# Altium schematic sheet Prijemnik.SchDoc
size A3
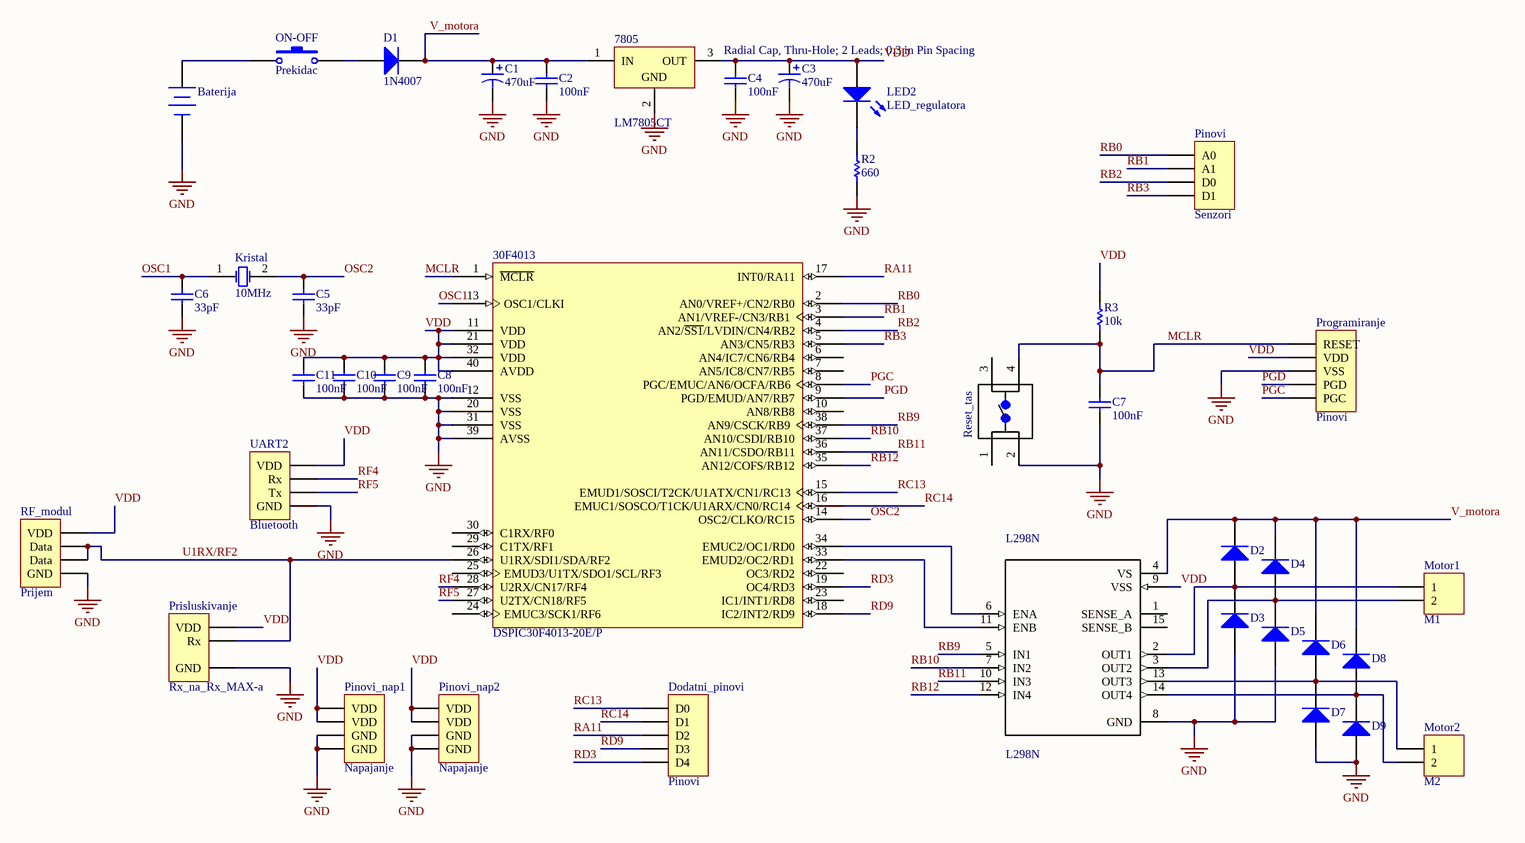
[diagram p0: Prijemnik.SchDoc]

## Parts
30F4013  DSPIC30F4013-20E/P  [PDIP600-P40]
7805  LM7805CT  [T03B]
Baterija  9V  [BAT-2]  (value not drawn)
C1  470uF  [El. Kondenzator 470uf]
C2  100nF  [C blok 100n]
C3  470uF  [El. Kondenzator 470uf]
C4  100nF  PackageDescription: Radial Cap, Thru-Hole; 2 Leads; 0.3 in Pin Spacing  [C blok 100n]
C5  33pF  [C keramicki 30pF]
C6  33pF  [C keramicki 30pF]
C7  100nF  [C blok 100n]
C8  100nF  [C blok 100n]
C9  100nF  [C blok 100n]
C10  100nF  [C blok 100n]
C11  100nF  [C blok 100n]
D1  1N4007  [DO-41]
D2  Diode 1N4007  [DO-41]  (value not drawn)
D3  Diode 1N4007  [DO-41]  (value not drawn)
D4  Diode 1N4007  [DO-41]  (value not drawn)
D5  Diode 1N4007  [DO-41]  (value not drawn)
D6  Diode 1N4007  [DO-41]  (value not drawn)
D7  Diode 1N4007  [DO-41]  (value not drawn)
D8  Diode 1N4007  [DO-41]  (value not drawn)
D9  Diode 1N4007  [DO-41]  (value not drawn)
Dodatni_pinovi  Pinovi  [HDR1X5]
Kristal  10MHz  [R38]
L298N  L298N  [*TO127P2020X500X2100-15]
LED2  LED_regulatora  [LED_5mm]
Motor1  M1  [HDR1X2]
Motor2  M2  [HDR1X2]
ON-OFF  Prekidac  [SPST-2]
Pinovi  Senzori  [HDR1X4]
Pinovi_nap1  Napajanje  [HDR1X4]
Pinovi_nap2  Napajanje  [HDR1X4]
Prisluskivanje  Rx_na_Rx_MAX-a  [HDR1X3]
Programiranje  Pinovi  [HDR1X5]
R2  660  [AXIAL-0.3]
R3  10k  [AXIAL-0.3]
Reset_tas  3-1825910-1  [*TE_3-1825910-1]  (value not drawn)
RF_modul  Prijem  [HDR1X4]
UART2  Bluetooth  [HDR1X4]

## Nets
GND: 30F4013.12(VSS) 30F4013.20(VSS) 30F4013.31(VSS) 30F4013.39(AVSS) 7805.2(GND) Baterija.2(-) C1.2 C2.1 C3.2 C4.1 C5.1 C6.1 C7.1 C8.1 C9.1 C10.1 C11.1 D3.1(A) D5.1(A) D7.1(A) D9.1(A) L298N.8(GND) Pinovi_nap1.3(GND) Pinovi_nap1.4(GND) Pinovi_nap2.3(GND) Pinovi_nap2.4(GND) Prisluskivanje.3(GND) Programiranje.3(VSS) R2.1 Reset_tas.2 RF_modul.4(GND) UART2.4(GND)
MCLR: 30F4013.1(~{MCLR}) C7.2 Programiranje.1(RESET) R3.1 Reset_tas.4
OSC1: 30F4013.13(OSC1/CLKI) C6.2 Kristal.1(OSC1)
OSC2: 30F4013.14(OSC2/CLKO/RC15) C5.2 Kristal.2(OSC2)
PGC: 30F4013.8(PGC/EMUC/AN6/OCFA/RB6) Programiranje.5(PGC)
PGD: 30F4013.9(PGD/EMUD/AN7/RB7) Programiranje.4(PGD)
RA11: 30F4013.17(INT0/RA11) Dodatni_pinovi.3(D2)
RB0: 30F4013.2(AN0/VREF+/CN2/RB0) Pinovi.1(A0)
RB1: 30F4013.3(AN1/VREF-/CN3/RB1) Pinovi.2(A1)
RB2: 30F4013.4(AN2/~{SS1}/LVDIN/CN4/RB2) Pinovi.3(D0)
RB3: 30F4013.5(AN3/CN5/RB3) Pinovi.4(D1)
RB9: 30F4013.38(AN9/CSCK/RB9) L298N.5(IN1)
RB10: 30F4013.37(AN10/CSDI/RB10) L298N.7(IN2)
RB11: 30F4013.36(AN11/CSDO/RB11) L298N.10(IN3)
RB12: 30F4013.35(AN12/COFS/RB12) L298N.12(IN4)
RC13: 30F4013.15(EMUD1/SOSCI/T2CK/U1ATX/CN1/RC13) Dodatni_pinovi.1(D0)
RC14: 30F4013.16(EMUC1/SOSCO/T1CK/U1ARX/CN0/RC14) Dodatni_pinovi.2(D1)
RD3: 30F4013.19(OC4/RD3) Dodatni_pinovi.5(D4)
RD9: 30F4013.18(IC2/INT2/RD9) Dodatni_pinovi.4(D3)
RF4: 30F4013.28(U2RX/CN17/RF4) UART2.2(Rx)
RF5: 30F4013.27(U2TX/CN18/RF5) UART2.3(Tx)
U1RX/RF2: 30F4013.26(U1RX/SDI1/SDA/RF2) Prisluskivanje.2(Rx) RF_modul.2(Data) RF_modul.3(Data)
V_motora: 7805.1(IN) C1.1 C2.2 D1.2(K) D2.2(K) D4.2(K) D6.2(K) D8.2(K) L298N.4(VS)
VDD: 30F4013.11(VDD) 30F4013.21(VDD) 30F4013.32(VDD) 30F4013.40(AVDD) 7805.3(OUT) C3.1 C4.2 C8.2 C9.2 C10.2 C11.2 L298N.9(VSS) LED2.1(A) Pinovi_nap1.1(VDD) Pinovi_nap1.2(VDD) Pinovi_nap2.1(VDD) Pinovi_nap2.2(VDD) Prisluskivanje.1(VDD) Programiranje.2(VDD) R3.2 RF_modul.1(VDD) UART2.1(VDD)
Net30F4013_33: 30F4013.33(EMUD2/OC2/RD1) L298N.11(ENB)
Net30F4013_34: 30F4013.34(EMUC2/OC1/RD0) L298N.6(ENA)
NetBaterija_1: Baterija.1(+) ON-OFF.1
NetD1_1: D1.1(A) ON-OFF.2
NetD2_1: D2.1(A) D3.2(K) L298N.2(OUT1) Motor1.1
NetD4_1: D4.1(A) D5.2(K) L298N.3(OUT2) Motor1.2
NetD6_1: D6.1(A) D7.2(K) L298N.13(OUT3) Motor2.1
NetD8_1: D8.1(A) D9.2(K) L298N.14(OUT4) Motor2.2
NetLED2_2: LED2.2(K) R2.2

Not connected (* = marked no-connect by the designer): 30F4013 6(AN4/IC7/CN6/RB4) 7(AN5/IC8/CN7/RB5) 10(AN8/RB8) 22(OC3/RD2) 23(IC1/INT1/RD8) 24(EMUC3/SCK1/RF6) 25(EMUD3/U1TX/SDO1/SCL/RF3) 29(C1TX/RF1) 30(C1RX/RF0); L298N 1(SENSE_A) 15(SENSE_B); Reset_tas 1 3

## Library data of the parts
30F4013 = DSPIC30F4013-20E/P: High-Performance 16-bit Digital Signal Controller, 48 KB Flash, 2 KB SRAM, 1 KB EEPROM, 40-Pin PDIP, Extended High Temperature; Published: 29-Jan-2009; DatasheetVersion: revF, Apr-2008; PackageVersion: revBB, Aug-2009; PackageReference: PDIP600-P40; Publisher: Altium Limited; PackageDescription: 40-Lead Plastic Dual In-Line (P) - 600 mil Body [PDIP]; Supplier 1: Digi-Key; Supplier Part Number 1: DSPIC30F4013-20EP-ND; ComponentLink1Description: Datasheet; ComponentLink1URL: http://ww1.microchip.com/downloads/en/DeviceDoc/70138F.pdf; ComponentLink2Description: Packaging Specification; ComponentLink2URL: http://www.microchip.com/stellent/groups/techpub_sg/documents/packagingspec/en012702.pdf; ComponentLink3Description: Microchip.com Home; ComponentLink3URL: http://www.microchip.com/
7805 = LM7905CT: 3-Terminal Negative Regulator, 3-pin TO-220; Manufacturer: National Semiconductor; PackageTopMarking: NSUZXYTTE#*LM7905CT; PowerWise: N; CompType: LDO IC; Published: 4-Dec-2008; DatasheetVersion: Sep-2001; PackageVersion: revL, Jan-1992; PackageReference: T03B; Publisher: Altium Limited; PackageDescription: TO-220, Molded, 3 Lead, Straight; Supplier 1: Farnell; Supplier Part Number 1: 9490370; PartNumber: LM7905CT; RoHS: N; PinCount: 3; ComponentLink1Description: LM7905 Datasheet; ComponentLink1URL: http://www.national.com/ds/LM/LM7905.pdf; ComponentLink2Description: LM7905 Web Page; ComponentLink2URL: http://www.national.com/pf/LM/LM7905.html; ComponentLink3Description: T03B Package Page; ComponentLink3URL: http://www.national.com/packaging/folders/t03b.html
Baterija = Battery: Multicell Battery; Published: 24-Mar-1999; LatestRevisionDate: 17-Jul-2002; LatestRevisionNote: Re-released for DXP Platform.; PackageReference: BAT-2; Publisher: Altium Limited; PackageDescription: Battery; 2 Leads
C1 C3 = Cap Pol1: Polarized Capacitor (Radial); Published: 8-Jun-2000; LatestRevisionDate: 17-Jul-2002; LatestRevisionNote: Re-released for DXP Platform.; PackageReference: RB7.6-15; Publisher: Altium Limited; PackageDescription: Polarized Capacitor (Radial); 2 Leads; Value: 470uF
C2 C4-C11 = Cap: Capacitor; Published: 8-Jun-2000; LatestRevisionDate: 17-Jul-2002; LatestRevisionNote: Re-released for DXP Platform.; PackageReference: RAD-0.3; Publisher: Altium Limited
  C2 C7-C11: PackageDescription: Radial Cap, Thru-Hole; 2 Leads; 0.3 in Pin Spacing; Value: 100nF
  C4: Value: 100nF
  C5 C6: PackageDescription: Radial Cap, Thru-Hole; 2 Leads; 0.3 in Pin Spacing; Value: 33pF
D1-D9 = Diode 1N4007: 1 Amp General Purpose Rectifier; Published: 8-Jun-2000; LatestRevisionDate: 17-Jul-2002; LatestRevisionNote: Re-released for DXP Platform.; DatasheetVersion: 1998; PackageVersion: Aug-1999; PackageReference: DO-41; Publisher: Altium Limited; PackageDescription: Diode, Axial; Body 5.2 x 2.7 mm (LxDia. max), Lead Dia. 0.86 mm (max); Code_JEDEC: DO-204-AL; ComponentLink1Description: Manufacturer Link; ComponentLink1URL: http://www.fairchildsemi.com/; ComponentLink2Description: Datasheet; ComponentLink2URL: http://www.fairchildsemi.com/ds/1N%2F1N4001.pdf
Dodatni_pinovi Programiranje = Header 5: Header, 5-Pin; LatestRevisionDate: 17-Jul-2002; LatestRevisionNote: Re-released for DXP Platform.; Publisher: Altium Limited
Kristal = XTAL: Crystal Oscillator; Published: 8-Jun-2000; LatestRevisionDate: 17-Jul-2002; LatestRevisionNote: Re-released for DXP Platform.; PackageReference: R38; Publisher: Altium Limited; PackageDescription: Crystal, Thru-Hole; 2 Leads; Body 3.1 x 8.2 mm (Dia.xH)
L298N = L298N: Half Bridge _4_ Driver DC Motors, Relays, Solenoids, Stepper Motors Bipolar 15-Multiwatt; MF: STMicroelectronics; MP: L298N; Price: None; Package: Multiwatt-15 STMicroelectronics; Availability: Unavailable; SnapEDA_Link: https://www.snapeda.com/parts/L298N/STMicroelectronics/view-part/294022/?ref=snap; Value: *
LED2 = LED1: Typical RED GaAs LED; Published: 8-Jun-2000; LatestRevisionDate: 08-Jul-2005; LatestRevisionNote: Mech Layer 1 removed.; PackageReference: LED-1; Publisher: Altium Limited; PackageDescription: LED; 2 Leads
Motor1 Motor2 = Header 2: Header, 2-Pin; LatestRevisionDate: 17-Jul-2002; LatestRevisionNote: Re-released for DXP Platform.; Publisher: Altium Limited
ON-OFF = SW-PB: Switch; Published: 24-Mar-1999; LatestRevisionDate: 17-Jul-2002; LatestRevisionNote: Re-released for DXP Platform.; PackageReference: SPST-2; Publisher: Altium Limited; PackageDescription: Switch; 2 Leads
Pinovi Pinovi_nap1 Pinovi_nap2 Prisluskivanje RF_modul UART2 = Header 4: Header, 4-Pin; LatestRevisionDate: 17-Jul-2002; LatestRevisionNote: Re-released for DXP Platform.; Publisher: Altium Limited
R2 R3 = Res1: Resistor; Published: 8-Jun-2000; LatestRevisionDate: 17-Jul-2002; LatestRevisionNote: Re-released for DXP Platform.; PackageReference: AXIAL-0.3; Publisher: Altium Limited; PackageDescription: Axial Device, Thru-Hole; 2 Leads; 0.3 in Pin Spacing
  R2: Value: 660
  R3: Value: 10K
Reset_tas = 3-1825910-1: Switch Push Button OFF _ON_ SPST Round Button 0.05A 24VDC Momentary Contact PC Pins Thru-Hole; MF: TE Connectivity; Package: None; Price: None; SnapEDA_Link: https://www.snapeda.com/parts/3-1825910-1/TE%20Connectivity%20ALCOSWITCH%20Switches/view-part/452461/?ref=snap; TE_purchase_URL: https://www.te.com/usa-en/product-3-1825910-1.html?te_bu=Cor&te_type=disp&te_campaign=seda_glo_cor-seda-global-disp-prtnr-fy19-seda-model-bom-cta_sma-317_1&elqCampaignId=32493; MP: 3-1825910-1; EU_RoHS_Compliance: Compliant; Availability: Unavailable; Value: *